# Altium schematic sheet DriveInterface.SchDoc: DriveInterface
size A; Engineer: Prasoon Sinha; DocumentNumber: 16; SheetNumber: 16; SheetTotal: 26
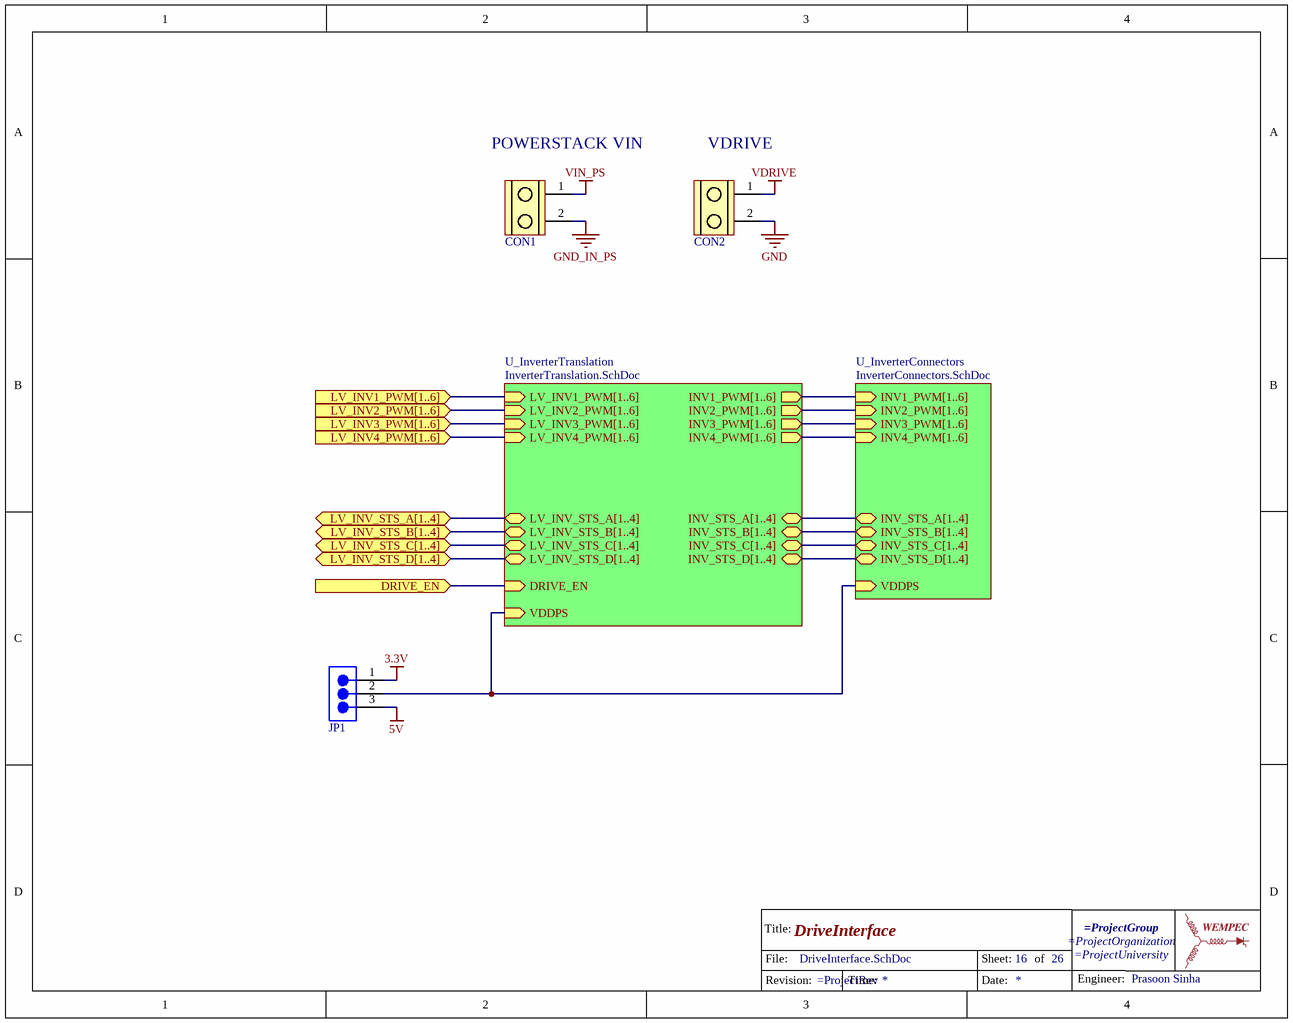
[diagram p0: DriveInterface.SchDoc]

## Parts
*?  TitleBlockWEMPEC  (value not drawn)  (graphical)
CON1  ScrewTerminal_1x2  [1935161]  (value not drawn)
CON2  ScrewTerminal_1x2  [1935161]  (value not drawn)
JP1  Jumper3  [PIN_HEADER_1X3]  (value not drawn)

## Sub-sheets
U_InverterConnectors = InverterConnectors.SchDoc: INV1_PWM[1..6] (in), INV3_PWM[1..6] (in), INV4_PWM[1..6] (in), INV2_PWM[1..6] (in), INV_STS_A[1..4] (bidir), INV_STS_C[1..4] (bidir), INV_STS_B[1..4] (bidir), INV_STS_D[1..4] (bidir), VDDPS (in)
U_InverterTranslation = InverterTranslation.SchDoc: LV_INV2_PWM[1..6] (in), LV_INV3_PWM[1..6] (in), LV_INV4_PWM[1..6] (in), LV_INV1_PWM[1..6] (in), DRIVE_EN (in), LV_INV_STS_A[1..4] (bidir), LV_INV_STS_D[1..4] (bidir), LV_INV_STS_C[1..4] (bidir), LV_INV_STS_B[1..4] (bidir), INV2_PWM[1..6] (out), INV3_PWM[1..6] (out), INV4_PWM[1..6] (out), INV1_PWM[1..6] (out), INV_STS_A[1..4] (bidir), INV_STS_B[1..4] (bidir), INV_STS_D[1..4] (bidir), INV_STS_C[1..4] (bidir), VDDPS (in)

## Ports
DRIVE_EN (in), LV_INV1_PWM[1..6] (in), LV_INV2_PWM[1..6] (in), LV_INV3_PWM[1..6] (in), LV_INV4_PWM[1..6] (in), LV_INV_STS_A[1..4] (bidir), LV_INV_STS_B[1..4] (bidir), LV_INV_STS_C[1..4] (bidir), LV_INV_STS_D[1..4] (bidir)

## Nets
3.3V: JP1.1
5V: JP1.3
GND: CON2.2
GND_IN_PS: CON1.2
VDRIVE: CON2.1
VIN_PS: CON1.1
DRIVE_EN: port DRIVE_EN, sheet U_InverterTranslation/DRIVE_EN
NetJP1_2: JP1.2 ; sheet U_InverterConnectors/VDDPS, sheet U_InverterTranslation/VDDPS

## Buses and harness runs
bus port LV_INV1_PWM[1..6] = sheet U_InverterTranslation/LV_INV1_PWM[1..6]
bus port LV_INV2_PWM[1..6] = sheet U_InverterTranslation/LV_INV2_PWM[1..6]
bus port LV_INV3_PWM[1..6] = sheet U_InverterTranslation/LV_INV3_PWM[1..6]
bus port LV_INV4_PWM[1..6] = sheet U_InverterTranslation/LV_INV4_PWM[1..6]
bus port LV_INV_STS_A[1..4] = sheet U_InverterTranslation/LV_INV_STS_A[1..4]
bus port LV_INV_STS_B[1..4] = sheet U_InverterTranslation/LV_INV_STS_B[1..4]
bus port LV_INV_STS_C[1..4] = sheet U_InverterTranslation/LV_INV_STS_C[1..4]
bus port LV_INV_STS_D[1..4] = sheet U_InverterTranslation/LV_INV_STS_D[1..4]
bus sheet U_InverterConnectors/INV1_PWM[1..6] = sheet U_InverterTranslation/INV1_PWM[1..6]
bus sheet U_InverterConnectors/INV2_PWM[1..6] = sheet U_InverterTranslation/INV2_PWM[1..6]
bus sheet U_InverterConnectors/INV3_PWM[1..6] = sheet U_InverterTranslation/INV3_PWM[1..6]
bus sheet U_InverterConnectors/INV4_PWM[1..6] = sheet U_InverterTranslation/INV4_PWM[1..6]
bus sheet U_InverterConnectors/INV_STS_A[1..4] = sheet U_InverterTranslation/INV_STS_A[1..4]
bus sheet U_InverterConnectors/INV_STS_B[1..4] = sheet U_InverterTranslation/INV_STS_B[1..4]
bus sheet U_InverterConnectors/INV_STS_C[1..4] = sheet U_InverterTranslation/INV_STS_C[1..4]
bus sheet U_InverterConnectors/INV_STS_D[1..4] = sheet U_InverterTranslation/INV_STS_D[1..4]

## Notes on the sheet
- (near CON1) POWERSTACK VIN
- (near CON2) VDRIVE
- (in symbol TitleBlockWEMPEC) Title:; File:; Sheet:; of; Engineer:; Revision:; Time:; Date:

## Library data of the parts
CON1 CON2 = ScrewTerminal_1x2: Supplier 1: Digi-Key; Supplier Part Number 1: 277-1667-ND
JP1 = Jumper3: Supplier 1: Digi-Key; Supplier Part Number 1: 732-5316-ND